# EAGLE schematic CAN demo board (EAGLE 9.2.2)
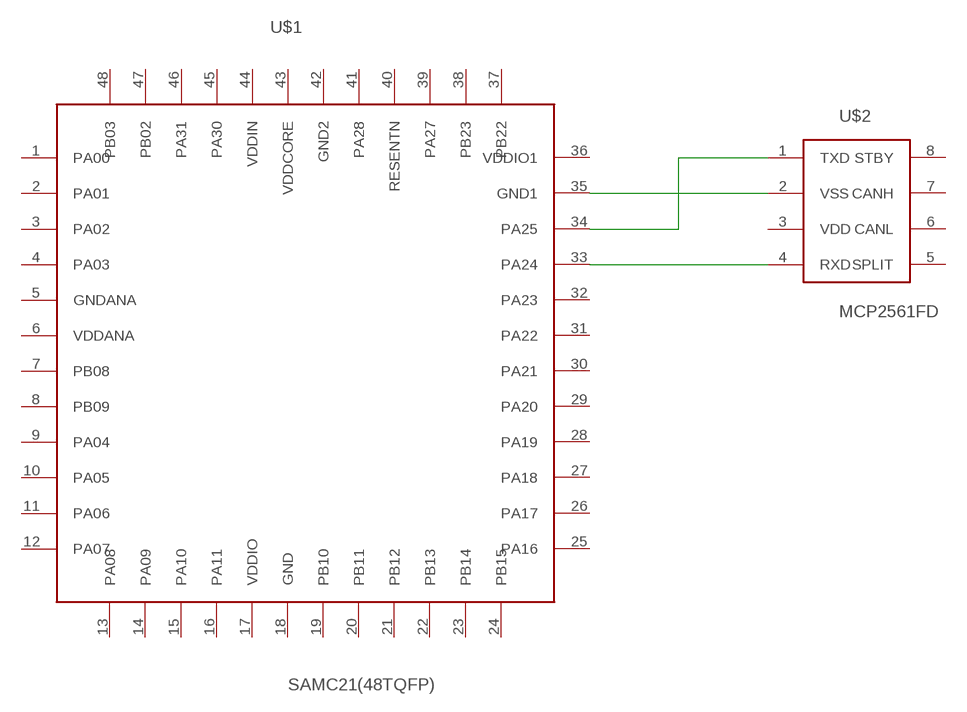
[diagram p0: schematic, sheet 1]

## Parts
U$1  SAMC21(48TQFP)  [TQFP-48]
U$2  MCP2561FD  [SOIC-8]

## Nets
N$2: U$1.34(PA25) U$2.1(TXD)
N$3: U$1.35(GND1) U$2.2(VSS)
N$4: U$1.33(PA24) U$2.4(RXD)
Unconnected: U$1.1(PA00) U$1.2(PA01) U$1.3(PA02) U$1.4(PA03) U$1.5(GNDANA) U$1.6(VDDANA) U$1.7(PB08) U$1.8(PB09) U$1.9(PA04) U$1.10(PA05) U$1.11(PA06) U$1.12(PA07) U$1.13(PA08) U$1.14(PA09) U$1.15(PA10) U$1.16(PA11) U$1.17(VDDIO) U$1.18(GND) U$1.19(PB10) U$1.20(PB11) U$1.21(PB12) U$1.22(PB13) U$1.23(PB14) U$1.24(PB15) U$1.25(PA16) U$1.26(PA17) U$1.27(PA18) U$1.28(PA19) U$1.29(PA20) U$1.30(PA21) U$1.31(PA22) U$1.32(PA23) U$1.36(VDDIO1) U$1.37(PB22) U$1.38(PB23) U$1.39(PA27) U$1.40(RESENTN) U$1.41(PA28) U$1.42(GND2) U$1.43(VDDCORE) U$1.44(VDDIN) U$1.45(PA30) U$1.46(PA31) U$1.47(PB02) U$1.48(PB03) U$2.3(VDD) U$2.5(SPLIT) U$2.6(CANL) U$2.7(CANH) U$2.8(STBY)

## Library data of the parts
U$1 = my library:SAMC21(48TQFP): SAM C21 micro in 48-tqfp package
U$2 = my library:MCP2561FD: CAN-FD transceiver